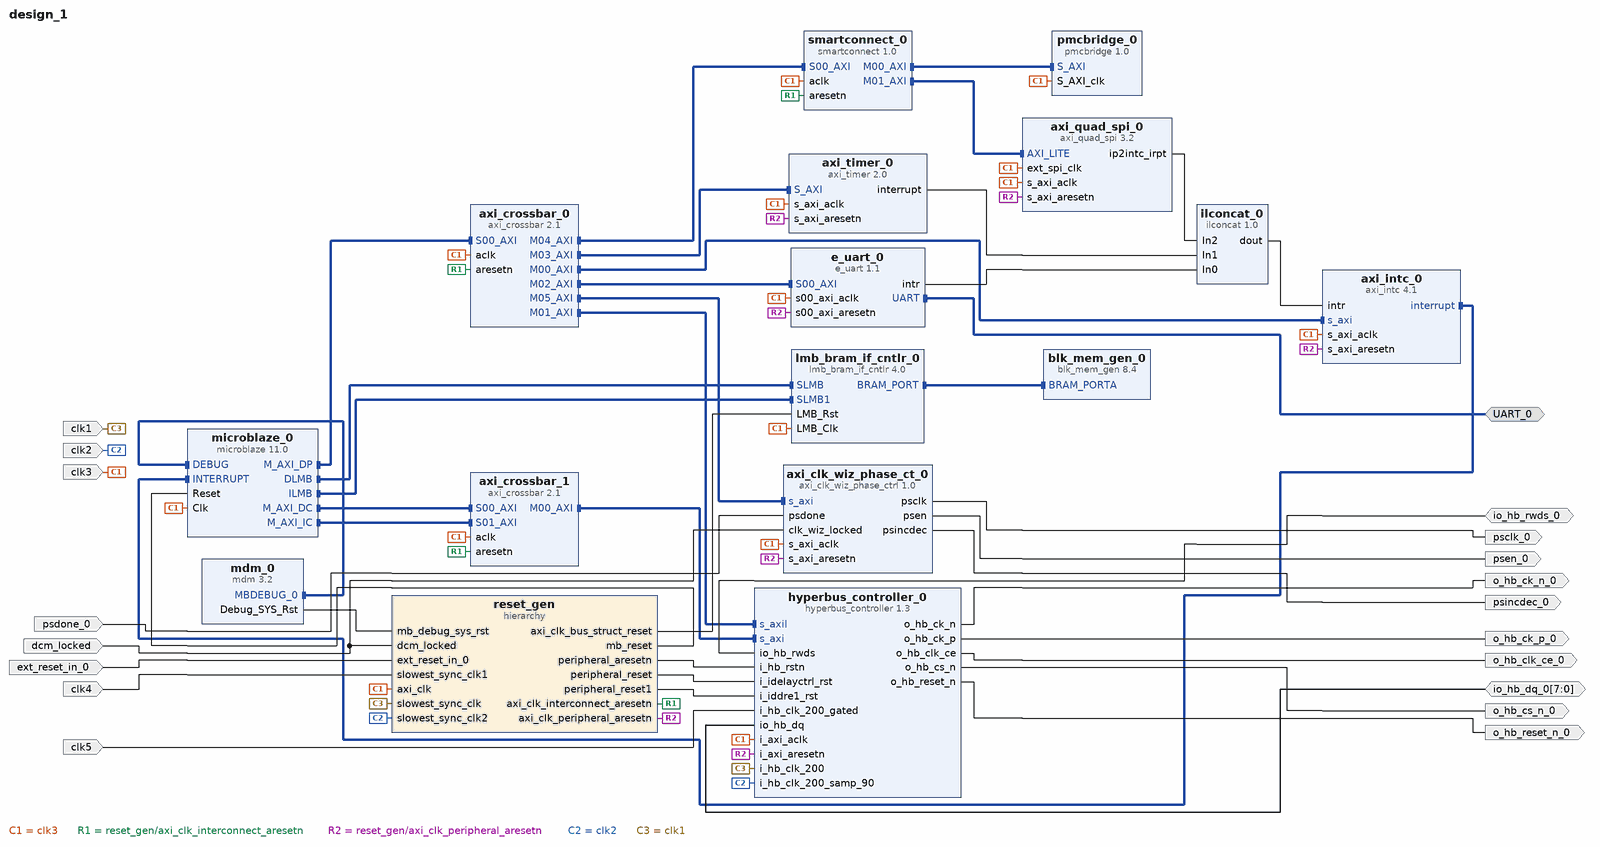
[diagram p0: block diagram of the top level]
# Vivado block design design_1, xcsu35p-sbvb625-2-e, Vivado 2025.2
create_bd_design design_1

create_bd_intf_port -mode Master -vlnv xilinx.com:interface:uart_rtl:1.0 UART_0
create_bd_port -dir O o_hb_reset_n_0
create_bd_port -dir I -type rst ext_reset_in_0
create_bd_port -dir O o_hb_cs_n_0
create_bd_port -dir O o_hb_ck_p_0
create_bd_port -dir O o_hb_ck_n_0
create_bd_port -dir IO io_hb_rwds_0
create_bd_port -dir IO -from 7 -to 0 io_hb_dq_0
create_bd_port -dir I -type clk clk1
set_property -dict {CONFIG.FREQ_HZ 200000000} [get_bd_ports clk1]
create_bd_port -dir I -type clk clk2
set_property -dict {CONFIG.FREQ_HZ 200000000} [get_bd_ports clk2]
create_bd_port -dir I -type clk clk3
set_property -dict {CONFIG.FREQ_HZ 50000000} [get_bd_ports clk3]
create_bd_port -dir I -type clk clk4
set_property -dict {CONFIG.FREQ_HZ 300000000} [get_bd_ports clk4]
create_bd_port -dir I -type clk clk5
set_property -dict {CONFIG.FREQ_HZ 200000000} [get_bd_ports clk5]
create_bd_port -dir O o_hb_clk_ce_0
create_bd_port -dir I dcm_locked
create_bd_port -dir I psdone_0
create_bd_port -dir O psclk_0
create_bd_port -dir O psen_0
create_bd_port -dir O psincdec_0

create_bd_cell -type ip -vlnv xilinx.com:ip:axi_crossbar:2.1 axi_crossbar_0
set_property -dict {CONFIG.NUM_MI 6 CONFIG.NUM_SI 1} [get_bd_cells axi_crossbar_0]
create_bd_cell -type ip -vlnv xilinx.com:ip:blk_mem_gen:8.4 blk_mem_gen_0
create_bd_cell -type ip -vlnv xilinx.com:ip:lmb_bram_if_cntlr:4.0 lmb_bram_if_cntlr_0
set_property -dict {CONFIG.C_NUM_LMB 2} [get_bd_cells lmb_bram_if_cntlr_0]
create_bd_cell -type ip -vlnv xilinx.com:ip:axi_intc:4.1 axi_intc_0
create_bd_cell -type ip -vlnv xilinx.com:ip:axi_crossbar:2.1 axi_crossbar_1
set_property -dict [list \
  CONFIG.CONNECTIVITY_MODE SAMD \
  CONFIG.DATA_WIDTH 32 \
  CONFIG.ID_WIDTH 1 \
  CONFIG.M00_S01_WRITE_CONNECTIVITY 0 \
  CONFIG.M01_S01_WRITE_CONNECTIVITY 0 \
  CONFIG.NUM_MI 1 \
  CONFIG.NUM_SI 2 \
] [get_bd_cells axi_crossbar_1]
create_bd_cell -type ip -vlnv xilinx.com:ip:axi_timer:2.0 axi_timer_0
create_bd_cell -type inline_hdl -vlnv xilinx.com:inline_hdl:ilconcat:1.0 ilconcat_0
set_property -dict {CONFIG.NUM_PORTS 3} [get_bd_cells ilconcat_0]
create_bd_cell -type hier reset_gen
create_bd_cell -type ip -vlnv github.com:user:e_uart:1.1 e_uart_0
create_bd_cell -type ip -vlnv xilinx.com:ip:axi_quad_spi:3.2 axi_quad_spi_0
set_property -dict [list \
  CONFIG.C_FIFO_DEPTH 256 \
  CONFIG.C_SPI_MEMORY 2 \
  CONFIG.C_SPI_MODE 2 \
  CONFIG.C_USE_STARTUP 1 \
  CONFIG.C_USE_STARTUP_INT 1 \
] [get_bd_cells axi_quad_spi_0]
create_bd_cell -type ip -vlnv xilinx.com:ip:microblaze:11.0 microblaze_0
set_property -dict [list \
  CONFIG.C_AREA_OPTIMIZED 1 \
  CONFIG.C_DCACHE_BASEADDR 0x0000000080000000 \
  CONFIG.C_DCACHE_HIGHADDR 0x00000000807FFFFF \
  CONFIG.C_DCACHE_LINE_LEN 8 \
  CONFIG.C_DCACHE_USE_WRITEBACK 0 \
  CONFIG.C_DIV_ZERO_EXCEPTION 1 \
  CONFIG.C_D_AXI 1 \
  CONFIG.C_ENABLE_DISCRETE_PORTS 0 \
  CONFIG.C_FPU_EXCEPTION 1 \
  CONFIG.C_ICACHE_BASEADDR 0x0000000080000000 \
  CONFIG.C_ICACHE_HIGHADDR 0x00000000807FFFFF \
  CONFIG.C_ICACHE_LINE_LEN 8 \
  CONFIG.C_ILL_OPCODE_EXCEPTION 1 \
  CONFIG.C_M_AXI_D_BUS_EXCEPTION 1 \
  CONFIG.C_M_AXI_I_BUS_EXCEPTION 1 \
  CONFIG.C_OPCODE_0x0_ILLEGAL 1 \
  CONFIG.C_PVR 0 \
  CONFIG.C_UNALIGNED_EXCEPTIONS 1 \
  CONFIG.C_USE_BARREL 1 \
  CONFIG.C_USE_DCACHE 1 \
  CONFIG.C_USE_DIV 1 \
  CONFIG.C_USE_FPU 1 \
  CONFIG.C_USE_HW_MUL 1 \
  CONFIG.C_USE_ICACHE 1 \
  CONFIG.C_USE_MSR_INSTR 1 \
  CONFIG.C_USE_PCMP_INSTR 1 \
  CONFIG.C_USE_STACK_PROTECTION 1 \
] [get_bd_cells microblaze_0]
create_bd_cell -type ip -vlnv xilinx.com:ip:mdm:3.2 mdm_0
create_bd_cell -type ip -vlnv xilinx.com:ip:pmcbridge:1.0 pmcbridge_0
create_bd_cell -type ip -vlnv xilinx.com:ip:smartconnect:1.0 smartconnect_0
set_property -dict {CONFIG.NUM_MI 2 CONFIG.NUM_SI 1} [get_bd_cells smartconnect_0]
create_bd_cell -type ip -vlnv github.com:user:axi_clk_wiz_phase_ctrl:1.0 axi_clk_wiz_phase_ct_0
create_bd_cell -type ip -vlnv github.com:user:hyperbus_controller:1.3 hyperbus_controller_0
set_property -dict {CONFIG.PHY_IO_STYLE 1} [get_bd_cells hyperbus_controller_0]

# ---- hierarchy /reset_gen ----
current_bd_instance /reset_gen
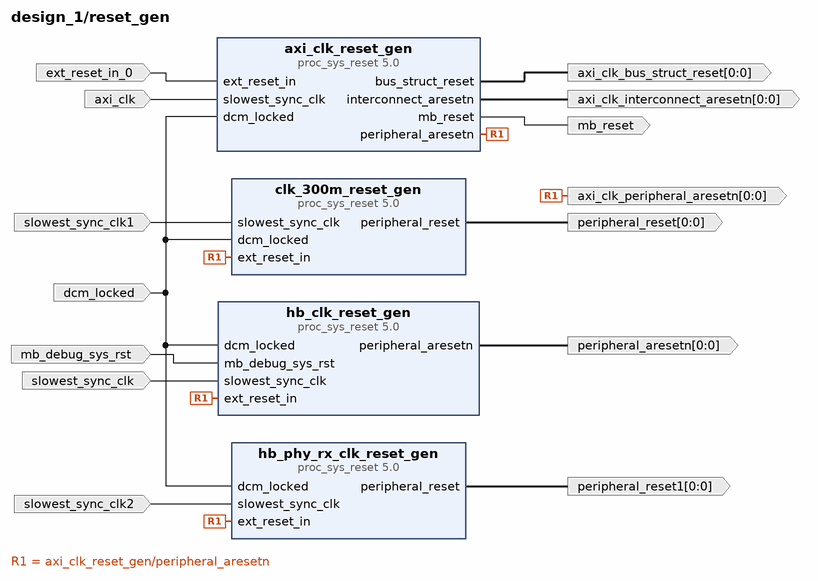
[diagram p1: block diagram inside /reset_gen]
create_bd_pin -dir I dcm_locked
create_bd_pin -dir I -type rst mb_debug_sys_rst
create_bd_pin -dir O -from 0 -to 0 -type rst axi_clk_interconnect_aresetn
create_bd_pin -dir O -from 0 -to 0 -type rst axi_clk_peripheral_aresetn
create_bd_pin -dir O -from 0 -to 0 -type rst axi_clk_bus_struct_reset
create_bd_pin -dir I -type clk axi_clk
create_bd_pin -dir O -type rst mb_reset
create_bd_pin -dir I -type rst ext_reset_in_0
create_bd_pin -dir I -type clk slowest_sync_clk
create_bd_pin -dir I -type clk slowest_sync_clk1
create_bd_pin -dir O -from 0 -to 0 -type rst peripheral_aresetn
create_bd_pin -dir O -from 0 -to 0 -type rst peripheral_reset
create_bd_pin -dir I -type clk slowest_sync_clk2
create_bd_pin -dir O -from 0 -to 0 -type rst peripheral_reset1

create_bd_cell -type ip -vlnv xilinx.com:ip:proc_sys_reset:5.0 hb_clk_reset_gen
create_bd_cell -type ip -vlnv xilinx.com:ip:proc_sys_reset:5.0 axi_clk_reset_gen
create_bd_cell -type ip -vlnv xilinx.com:ip:proc_sys_reset:5.0 clk_300m_reset_gen
create_bd_cell -type ip -vlnv xilinx.com:ip:proc_sys_reset:5.0 hb_phy_rx_clk_reset_gen

# ---- connections ----

current_bd_instance /reset_gen
connect_bd_net [get_bd_pins clk_300m_reset_gen/peripheral_reset] [get_bd_pins peripheral_reset]
connect_bd_net [get_bd_pins dcm_locked] \
  [get_bd_pins hb_clk_reset_gen/dcm_locked] [get_bd_pins axi_clk_reset_gen/dcm_locked] \
  [get_bd_pins clk_300m_reset_gen/dcm_locked] [get_bd_pins hb_phy_rx_clk_reset_gen/dcm_locked]
connect_bd_net -net ext_reset_in_0_1 [get_bd_pins ext_reset_in_0] [get_bd_pins axi_clk_reset_gen/ext_reset_in]
connect_bd_net [get_bd_pins hb_clk_reset_gen/peripheral_aresetn] [get_bd_pins peripheral_aresetn]
connect_bd_net [get_bd_pins hb_phy_rx_clk_reset_gen/peripheral_reset] [get_bd_pins peripheral_reset1]
connect_bd_net [get_bd_pins mb_debug_sys_rst] [get_bd_pins hb_clk_reset_gen/mb_debug_sys_rst]
connect_bd_net -net proc_sys_reset_1_bus_struct_reset [get_bd_pins axi_clk_reset_gen/bus_struct_reset] [get_bd_pins axi_clk_bus_struct_reset]
connect_bd_net -net proc_sys_reset_1_interconnect_aresetn [get_bd_pins axi_clk_reset_gen/interconnect_aresetn] \
  [get_bd_pins axi_clk_interconnect_aresetn]
connect_bd_net -net proc_sys_reset_1_mb_reset [get_bd_pins axi_clk_reset_gen/mb_reset] [get_bd_pins mb_reset]
connect_bd_net -net proc_sys_reset_1_peripheral_aresetn [get_bd_pins axi_clk_reset_gen/peripheral_aresetn] \
  [get_bd_pins hb_clk_reset_gen/ext_reset_in] [get_bd_pins axi_clk_peripheral_aresetn] \
  [get_bd_pins clk_300m_reset_gen/ext_reset_in] [get_bd_pins hb_phy_rx_clk_reset_gen/ext_reset_in]
connect_bd_net -net slowest_sync_clk1_1 [get_bd_pins axi_clk] [get_bd_pins axi_clk_reset_gen/slowest_sync_clk]
connect_bd_net -net slowest_sync_clk1_2 [get_bd_pins slowest_sync_clk1] [get_bd_pins clk_300m_reset_gen/slowest_sync_clk]
connect_bd_net -net slowest_sync_clk2_1 [get_bd_pins slowest_sync_clk2] [get_bd_pins hb_phy_rx_clk_reset_gen/slowest_sync_clk]
connect_bd_net [get_bd_pins slowest_sync_clk] [get_bd_pins hb_clk_reset_gen/slowest_sync_clk]

current_bd_instance /
connect_bd_intf_net [get_bd_intf_pins axi_crossbar_0/M00_AXI] [get_bd_intf_pins axi_intc_0/s_axi]
connect_bd_intf_net [get_bd_intf_pins axi_crossbar_0/M01_AXI] [get_bd_intf_pins hyperbus_controller_0/s_axil]
connect_bd_intf_net [get_bd_intf_pins e_uart_0/S00_AXI] [get_bd_intf_pins axi_crossbar_0/M02_AXI]
connect_bd_intf_net [get_bd_intf_pins axi_crossbar_0/M03_AXI] [get_bd_intf_pins axi_timer_0/S_AXI]
connect_bd_intf_net [get_bd_intf_pins axi_crossbar_0/M04_AXI] [get_bd_intf_pins smartconnect_0/S00_AXI]
connect_bd_intf_net [get_bd_intf_pins axi_crossbar_0/M05_AXI] [get_bd_intf_pins axi_clk_wiz_phase_ct_0/s_axi]
connect_bd_intf_net [get_bd_intf_pins axi_crossbar_1/M00_AXI] [get_bd_intf_pins hyperbus_controller_0/s_axi]
connect_bd_intf_net [get_bd_intf_pins axi_intc_0/interrupt] [get_bd_intf_pins microblaze_0/INTERRUPT]
connect_bd_intf_net [get_bd_intf_ports UART_0] [get_bd_intf_pins e_uart_0/UART]
connect_bd_intf_net [get_bd_intf_pins lmb_bram_if_cntlr_0/BRAM_PORT] [get_bd_intf_pins blk_mem_gen_0/BRAM_PORTA]
connect_bd_intf_net [get_bd_intf_pins mdm_0/MBDEBUG_0] [get_bd_intf_pins microblaze_0/DEBUG]
connect_bd_intf_net [get_bd_intf_pins microblaze_0/DLMB] [get_bd_intf_pins lmb_bram_if_cntlr_0/SLMB]
connect_bd_intf_net [get_bd_intf_pins microblaze_0/ILMB] [get_bd_intf_pins lmb_bram_if_cntlr_0/SLMB1]
connect_bd_intf_net [get_bd_intf_pins microblaze_0/M_AXI_DC] [get_bd_intf_pins axi_crossbar_1/S00_AXI]
connect_bd_intf_net [get_bd_intf_pins microblaze_0/M_AXI_DP] [get_bd_intf_pins axi_crossbar_0/S00_AXI]
connect_bd_intf_net -intf_net microblaze_riscv_0_M_AXI_IC [get_bd_intf_pins microblaze_0/M_AXI_IC] [get_bd_intf_pins axi_crossbar_1/S01_AXI]
connect_bd_intf_net [get_bd_intf_pins pmcbridge_0/S_AXI] [get_bd_intf_pins smartconnect_0/M00_AXI]
connect_bd_intf_net [get_bd_intf_pins smartconnect_0/M01_AXI] [get_bd_intf_pins axi_quad_spi_0/AXI_LITE]
connect_bd_net [get_bd_ports io_hb_rwds_0] [get_bd_pins hyperbus_controller_0/io_hb_rwds]
connect_bd_net [get_bd_ports io_hb_dq_0] [get_bd_pins hyperbus_controller_0/io_hb_dq]
connect_bd_net -net axi_clk [get_bd_ports clk3] \
  [get_bd_pins axi_crossbar_1/aclk] [get_bd_pins axi_crossbar_0/aclk] [get_bd_pins lmb_bram_if_cntlr_0/LMB_Clk] \
  [get_bd_pins axi_intc_0/s_axi_aclk] [get_bd_pins axi_timer_0/s_axi_aclk] [get_bd_pins reset_gen/axi_clk] \
  [get_bd_pins axi_quad_spi_0/ext_spi_clk] [get_bd_pins axi_quad_spi_0/s_axi_aclk] [get_bd_pins microblaze_0/Clk] \
  [get_bd_pins e_uart_0/s00_axi_aclk] [get_bd_pins pmcbridge_0/S_AXI_clk] [get_bd_pins smartconnect_0/aclk] \
  [get_bd_pins axi_clk_wiz_phase_ct_0/s_axi_aclk] [get_bd_pins hyperbus_controller_0/i_axi_aclk]
connect_bd_net [get_bd_pins axi_clk_wiz_phase_ct_0/psclk] [get_bd_ports psclk_0]
connect_bd_net [get_bd_pins axi_clk_wiz_phase_ct_0/psen] [get_bd_ports psen_0]
connect_bd_net [get_bd_pins axi_clk_wiz_phase_ct_0/psincdec] [get_bd_ports psincdec_0]
connect_bd_net [get_bd_pins axi_quad_spi_0/ip2intc_irpt] [get_bd_pins ilconcat_0/In2]
connect_bd_net [get_bd_pins axi_timer_0/interrupt] [get_bd_pins ilconcat_0/In1]
connect_bd_net -net clk5_1 [get_bd_ports clk5] [get_bd_pins hyperbus_controller_0/i_hb_clk_200_gated]
connect_bd_net -net clk_wiz_0_locked [get_bd_ports dcm_locked] [get_bd_pins reset_gen/dcm_locked] [get_bd_pins axi_clk_wiz_phase_ct_0/clk_wiz_locked]
connect_bd_net [get_bd_pins e_uart_0/intr] [get_bd_pins ilconcat_0/In0]
connect_bd_net -net ext_reset_in_0_1 [get_bd_ports ext_reset_in_0] [get_bd_pins reset_gen/ext_reset_in_0]
connect_bd_net [get_bd_pins hyperbus_controller_0/o_hb_ck_n] [get_bd_ports o_hb_ck_n_0]
connect_bd_net [get_bd_pins hyperbus_controller_0/o_hb_ck_p] [get_bd_ports o_hb_ck_p_0]
connect_bd_net [get_bd_pins hyperbus_controller_0/o_hb_clk_ce] [get_bd_ports o_hb_clk_ce_0]
connect_bd_net [get_bd_pins hyperbus_controller_0/o_hb_cs_n] [get_bd_ports o_hb_cs_n_0]
connect_bd_net [get_bd_pins hyperbus_controller_0/o_hb_reset_n] [get_bd_ports o_hb_reset_n_0]
connect_bd_net [get_bd_pins ilconcat_0/dout] [get_bd_pins axi_intc_0/intr]
connect_bd_net -net mb_debug_sys_rst_1 [get_bd_pins mdm_0/Debug_SYS_Rst] [get_bd_pins reset_gen/mb_debug_sys_rst]
connect_bd_net -net proc_sys_reset_1_interconnect_aresetn [get_bd_pins reset_gen/axi_clk_interconnect_aresetn] \
  [get_bd_pins axi_crossbar_0/aresetn] [get_bd_pins axi_crossbar_1/aresetn] [get_bd_pins smartconnect_0/aresetn]
connect_bd_net -net proc_sys_reset_1_peripheral_aresetn [get_bd_pins reset_gen/axi_clk_peripheral_aresetn] \
  [get_bd_pins axi_intc_0/s_axi_aresetn] [get_bd_pins axi_timer_0/s_axi_aresetn] [get_bd_pins axi_quad_spi_0/s_axi_aresetn] \
  [get_bd_pins e_uart_0/s00_axi_aresetn] [get_bd_pins axi_clk_wiz_phase_ct_0/s_axi_aresetn] \
  [get_bd_pins hyperbus_controller_0/i_axi_aresetn]
connect_bd_net -net psdone_0_1 [get_bd_ports psdone_0] [get_bd_pins axi_clk_wiz_phase_ct_0/psdone]
connect_bd_net -net reset_gen_bus_struct_reset [get_bd_pins reset_gen/axi_clk_bus_struct_reset] [get_bd_pins lmb_bram_if_cntlr_0/LMB_Rst]
connect_bd_net [get_bd_pins reset_gen/mb_reset] [get_bd_pins microblaze_0/Reset]
connect_bd_net [get_bd_pins reset_gen/peripheral_aresetn] [get_bd_pins hyperbus_controller_0/i_hb_rstn]
connect_bd_net [get_bd_pins reset_gen/peripheral_reset] [get_bd_pins hyperbus_controller_0/i_idelayctrl_rst]
connect_bd_net [get_bd_pins reset_gen/peripheral_reset1] [get_bd_pins hyperbus_controller_0/i_iddre1_rst]
connect_bd_net -net slowest_sync_clk1_1 [get_bd_ports clk4] [get_bd_pins reset_gen/slowest_sync_clk1]
connect_bd_net -net slowest_sync_clk2_1 [get_bd_ports clk2] \
  [get_bd_pins reset_gen/slowest_sync_clk2] [get_bd_pins hyperbus_controller_0/i_hb_clk_200_samp_90]
connect_bd_net -net slowest_sync_clk_1 [get_bd_ports clk1] [get_bd_pins reset_gen/slowest_sync_clk] [get_bd_pins hyperbus_controller_0/i_hb_clk_200]
set_property HDL_ATTRIBUTE.BMM_INFO_ADDRESS_SPACE {byte  0x00000000 32 > design_1 blk_mem_gen_0} [get_bd_cells lmb_bram_if_cntlr_0]
set_property HDL_ATTRIBUTE.KEEP_HIERARCHY yes [get_bd_cells lmb_bram_if_cntlr_0]
set_property HDL_ATTRIBUTE.BMM_INFO_PROCESSOR {microblaze-le > design_1 lmb_bram_if_cntlr_0} [get_bd_cells microblaze_0]
set_property HDL_ATTRIBUTE.KEEP_HIERARCHY yes [get_bd_cells microblaze_0]

# ---- address map ----
assign_bd_address -offset 0x00000000 -range 32K -target_address_space [get_bd_addr_spaces microblaze_0/Data] [get_bd_addr_segs lmb_bram_if_cntlr_0/SLMB/Mem]
assign_bd_address -offset 0x00010000 -range 64K -target_address_space [get_bd_addr_spaces microblaze_0/Data] [get_bd_addr_segs hyperbus_controller_0/s_axil/reg0]
assign_bd_address -offset 0x00020000 -range 4K -target_address_space [get_bd_addr_spaces microblaze_0/Data] [get_bd_addr_segs axi_clk_wiz_phase_ct_0/s_axi/reg0]
assign_bd_address -offset 0x04020000 -range 64K -target_address_space [get_bd_addr_spaces microblaze_0/Data] [get_bd_addr_segs pmcbridge_0/PLM_CONFIG/plm_config_0]
assign_bd_address -offset 0x04040000 -range 4K -target_address_space [get_bd_addr_spaces microblaze_0/Data] [get_bd_addr_segs pmcbridge_0/RV_IOMODULE/rv_iomodule_0]
assign_bd_address -offset 0x04041000 -range 4K -target_address_space [get_bd_addr_spaces microblaze_0/Data] [get_bd_addr_segs pmcbridge_0/RV_RAM_INSTR_ECC_CTRL/rv_ram_instr_ecc_ctrl_0]
assign_bd_address -offset 0x04042000 -range 4K -target_address_space [get_bd_addr_spaces microblaze_0/Data] [get_bd_addr_segs pmcbridge_0/RV_RAM_DATA_ECC_CTRL/rv_ram_data_ecc_ctrl_0]
assign_bd_address -offset 0x04050000 -range 64K -target_address_space [get_bd_addr_spaces microblaze_0/Data] [get_bd_addr_segs pmcbridge_0/SLAVE_BOOT_STREAM/slave_boot_stream_0]
assign_bd_address -offset 0x04060000 -range 64K -target_address_space [get_bd_addr_spaces microblaze_0/Data] [get_bd_addr_segs pmcbridge_0/CCU_RD_STREAM/ccu_rd_stream_0]
assign_bd_address -offset 0x04070000 -range 64K -target_address_space [get_bd_addr_spaces microblaze_0/Data] [get_bd_addr_segs pmcbridge_0/CCU_WR_STREAM/ccu_wr_stream_0]
assign_bd_address -offset 0x04080000 -range 64K -target_address_space [get_bd_addr_spaces microblaze_0/Data] [get_bd_addr_segs pmcbridge_0/PMCL_PUF/pmcl_puf_0]
assign_bd_address -offset 0x04090000 -range 64K -target_address_space [get_bd_addr_spaces microblaze_0/Data] [get_bd_addr_segs pmcbridge_0/PMCL_OSPI/pmcl_ospi_0]
assign_bd_address -offset 0x040A0000 -range 128K -target_address_space [get_bd_addr_spaces microblaze_0/Data] [get_bd_addr_segs pmcbridge_0/PMCL_GLOBAL/pmcl_global_0]
assign_bd_address -offset 0x040C0000 -range 128K -target_address_space [get_bd_addr_spaces microblaze_0/Data] [get_bd_addr_segs pmcbridge_0/PMCL_TAP/pmcl_tap_0]
assign_bd_address -offset 0x040E0000 -range 64K -target_address_space [get_bd_addr_spaces microblaze_0/Data] [get_bd_addr_segs pmcbridge_0/PMCL_DMA/pmcl_dma_0]
assign_bd_address -offset 0x040F0000 -range 64K -target_address_space [get_bd_addr_spaces microblaze_0/Data] [get_bd_addr_segs pmcbridge_0/PMC_AES/pmcl_aes_0]
assign_bd_address -offset 0x04100000 -range 64K -target_address_space [get_bd_addr_spaces microblaze_0/Data] [get_bd_addr_segs pmcbridge_0/PMCL_SHA3/pmcl_sha3_0]
assign_bd_address -offset 0x04110000 -range 64K -target_address_space [get_bd_addr_spaces microblaze_0/Data] [get_bd_addr_segs pmcbridge_0/PMCL_SLAVE_BOOT/pmcl_slave_boot_0]
assign_bd_address -offset 0x04120000 -range 64K -target_address_space [get_bd_addr_spaces microblaze_0/Data] [get_bd_addr_segs pmcbridge_0/PMCL_TRNG/pmcl_trng_0]
assign_bd_address -offset 0x04130000 -range 64K -target_address_space [get_bd_addr_spaces microblaze_0/Data] [get_bd_addr_segs pmcbridge_0/CCU_APB/ccu_apb_0]
assign_bd_address -offset 0x04160000 -range 64K -target_address_space [get_bd_addr_spaces microblaze_0/Data] [get_bd_addr_segs pmcbridge_0/PMCL_EFUSE/pmcl_efuse_0]
assign_bd_address -offset 0x41200000 -range 64K -target_address_space [get_bd_addr_spaces microblaze_0/Data] [get_bd_addr_segs axi_intc_0/S_AXI/Reg]
assign_bd_address -offset 0x41C00000 -range 64K -target_address_space [get_bd_addr_spaces microblaze_0/Data] [get_bd_addr_segs axi_timer_0/S_AXI/Reg]
assign_bd_address -offset 0x44A00000 -range 64K -target_address_space [get_bd_addr_spaces microblaze_0/Data] [get_bd_addr_segs axi_quad_spi_0/AXI_LITE/Reg]
assign_bd_address -offset 0x44A10000 -range 64K -target_address_space [get_bd_addr_spaces microblaze_0/Data] [get_bd_addr_segs e_uart_0/S00_AXI/S00_AXI_reg]
assign_bd_address -offset 0x80000000 -range 8M -target_address_space [get_bd_addr_spaces microblaze_0/Data] [get_bd_addr_segs hyperbus_controller_0/s_axi/reg0]
assign_bd_address -offset 0x00000000 -range 32K -target_address_space [get_bd_addr_spaces microblaze_0/Instruction] [get_bd_addr_segs lmb_bram_if_cntlr_0/SLMB1/Mem]
assign_bd_address -offset 0x80000000 -range 8M -target_address_space [get_bd_addr_spaces microblaze_0/Instruction] [get_bd_addr_segs hyperbus_controller_0/s_axi/reg0]

validate_bd_design
save_bd_design
